# Altium schematic sheet module 2_ACCEL_GYRO.SchDoc
size 242 x 148 mm
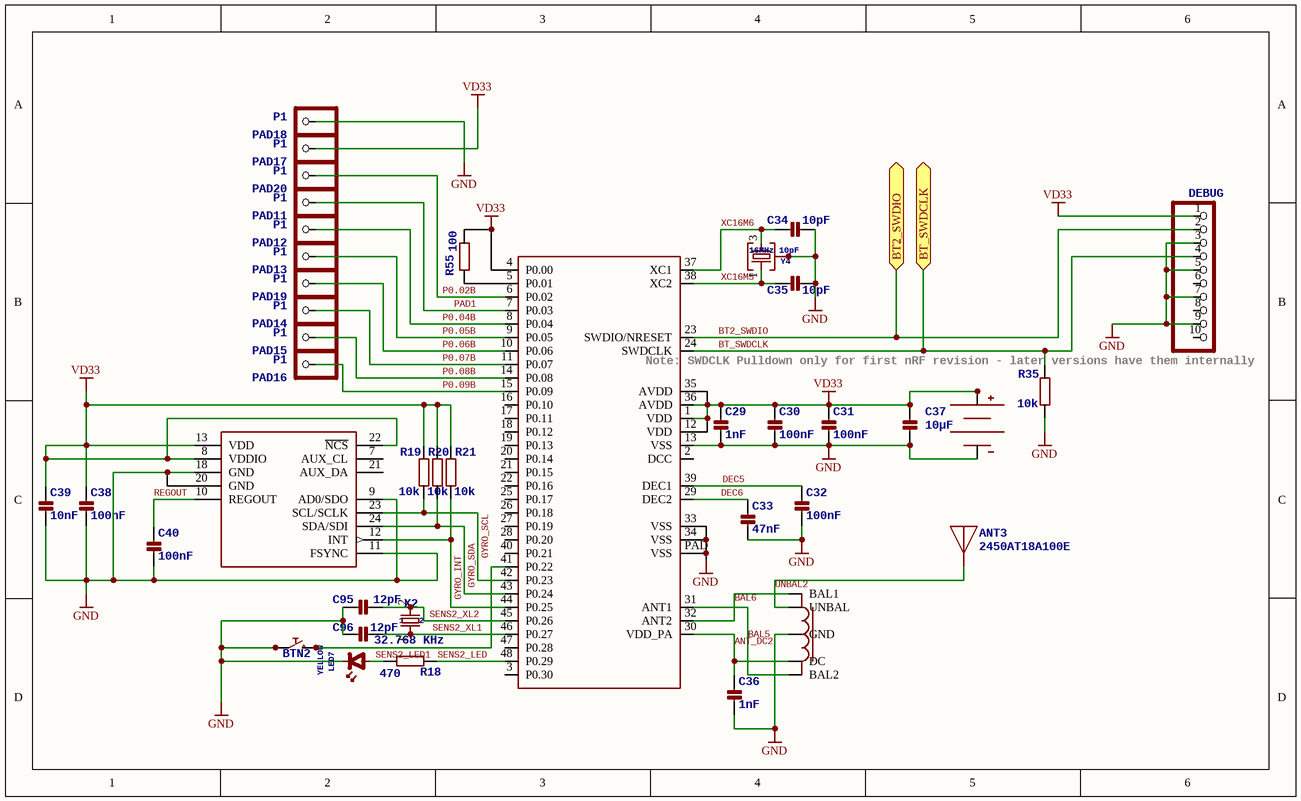
[diagram p0: module 2_ACCEL_GYRO.SchDoc]

## Parts
ANT3  2450AT18A100E  [1206_MINIMELF_COMBO]
BALUN2  2450BM14A0002T  [6-PIN-0603]  (value not drawn)
BAT2  BATTERYBK-912  [BK-912]  (value not drawn)
BT2  NRF51822QFN48  [QFN48_EP]  (value not drawn)
BTN2  Tact Sw 4.6x2.8  [CK-KMR2]  (value not drawn)
C29  1nF  [0402]
C30  100nF  [0402]
C31  100nF  [0402]
C32  100nF  [0402]
C33  47nF  [0402]
C34  10pF  [0402]
C35  10pF  [0402]
C36  1nF  [0402]
C37  10µF  [0603]
C38  100nF  [0402]
C39  10nF  [0402]
C40  100nF  [0402]
C95  12pF  [0402]
C96  12pF  [0402]
DEBUG2  DEBUG  [2X05_SMT]  (no BOM)
LED7  YELLOW  [0402_POLAR]
PAD11  P1  [PCB_MEDIUM_RECT_PAD]  (no BOM)
PAD12  P1  [PCB_MEDIUM_RECT_PAD]  (no BOM)
PAD13  P1  [PCB_MEDIUM_RECT_PAD]  (no BOM)
PAD14  P1  [PCB_MEDIUM_RECT_PAD]  (no BOM)
PAD15  P1  [PCB_MEDIUM_RECT_PAD]  (no BOM)
PAD16  P1  [PCB_MEDIUM_RECT_PAD]  (no BOM)
PAD17  P1  [PCB_MEDIUM_RECT_PAD]  (no BOM)
PAD18  P1  [PCB_MEDIUM_RECT_PAD]  (no BOM)
PAD19  P1  [PCB_MEDIUM_RECT_PAD]  (no BOM)
PAD20  P1  [PCB_MEDIUM_RECT_PAD]  (no BOM)
R18  470  [0402]
R19  10k  [0402]
R20  10k  [0402]
R21  10k  [0402]
R35  10k  [0402]
R55  100  [0402]
SENSE2  MPU6500QFN  [QFN24-0.4]  (value not drawn)
X2  32.768 KHz  [1206_MINIMELF_COMBO]
Y4  16MHz 10pF  [CRYSTAL25X20]

## Ports
BT2_SWDIO, BT_SWDCLK

## Nets
GND: BALUN2.2(GND) BAT2.- BT2.13(VSS) BT2.33(VSS) BT2.34(VSS) BT2.PAD(VSS) BTN2.P1 BTN2.P2 C29.2 C30.2 C31.2 C32.2 C33.2 C34.2 C35.2 C36.2 C37.2(P2) C38.2 C39.2 C40.2 C95.1 C96.1 DEBUG2.3 DEBUG2.5 DEBUG2.7 DEBUG2.9 LED7.K(CATHODE) PAD18.1 R35.1 SENSE2.9(AD0/SDO) SENSE2.11(FSYNC) SENSE2.18(GND) SENSE2.20(GND) Y4.2 Y4.4
VD33: BAT2.+1(+) BAT2.+2(+) BT2.1(VDD) BT2.4(P0.00) BT2.12(VDD) BT2.35(AVDD) BT2.36(AVDD) C29.1 C30.1 C31.1 C37.1(P1) C38.1 C39.1 DEBUG2.1 PAD17.1 R19.2 R20.2 R21.2 R55.1 SENSE2.8(VDDIO) SENSE2.13(VDD) SENSE2.22(~{NCS})
ANT_DC2: BALUN2.5(DC) BT2.30(VDD_PA) C36.1
BAL5: BALUN2.4(BAL2) BT2.31(ANT1)
BAL6: BALUN2.3(BAL1) BT2.32(ANT2)
BT2_SWDIO: BT2.23(SWDIO/NRESET) DEBUG2.2 ; port BT2_SWDIO
BT_SWDCLK: BT2.24(SWDCLK) DEBUG2.4 R35.2 ; port BT_SWDCLK
DEC5: BT2.39(DEC1) C32.1
DEC6: BT2.29(DEC2) C33.1
GYRO_INT: BT2.44(P0.25) R21.1 SENSE2.12(INT)
GYRO_SCL: BT2.42(P0.23) R19.1 SENSE2.23(SCL/SCLK)
GYRO_SDA: BT2.43(P0.24) R20.1 SENSE2.24(SDA/SDI)
P0.02B: BT2.6(P0.02) PAD20.1
P0.04B: BT2.8(P0.04) PAD12.1
P0.05B: BT2.9(P0.05) PAD13.1
P0.06B: BT2.10(P0.06) PAD19.1
P0.07B: BT2.11(P0.07) PAD14.1
P0.08B: BT2.14(P0.08) PAD15.1
P0.09B: BT2.15(P0.09) PAD16.1
PAD1: BT2.7(P0.03) PAD11.1
REGOUT: C40.1 SENSE2.10(REGOUT)
SENS2_LED: BT2.48(P0.29) R18.1
SENS2_LED1: LED7.A(ANODE) R18.2
SENS2_XL1: BT2.46(P0.27) C96.2 X2.1
SENS2_XL2: BT2.45(P0.26) C95.2 X2.2
UNBAL2: ANT3.1(ANT) BALUN2.1(UNBAL)
XC16M5: BT2.38(XC2) C35.1 Y4.1
XC16M6: BT2.37(XC1) C34.1 Y4.3
NetBT2_5: BT2.5(P0.01) R55.2
NetBT2_41: BT2.41(P0.22) BTN2.P3 BTN2.P4

Not connected (* = marked no-connect by the designer): BT2 2(DCC) 3(P0.30) 16(P0.10) 17(P0.11) 18(P0.12) 19(P0.13) 20(P0.14) 21(P0.15) 22(P0.16) 25(P0.17) 26(P0.18) 27(P0.19) 28(P0.20) 40(P0.21) 47(P0.28); DEBUG2 6 8 10; SENSE2 7(AUX_CL) 21(AUX_DA)

## Notes on the sheet
- (near BT2) Note: SWDCLK Pulldown only for first nRF revision - later versions have them internally

## Library data of the parts
ANT3 = ANTENNA_MONOPOLE1206: 2.45 GHz Antenna; SMD: Yes
BALUN2 = BALUN: 2.45 GHz Impedance Matched Balun-Filter; SMD: Yes
BAT2 = BATTERYBK-912: Coin battery holder; SMD: Yes
BT2 = NRF51822QFN48: Nordic Bluetooth 4.0 low energy modul; SMD: Yes
BTN2 = PUSHBUTTONKMR2XX: Push button; SMD: Yes
C29-C36 C38-C40 C95 C96 = CAP_CERAMIC0402: Ceramic Capacitor; SMD: Yes
C37 = CAP_CERAMIC0603: Ceramic Capacitor; SMD: Yes
DEBUG2 = HEADER-2X5SMD-1.27MM: cortex DEBUG connector
LED7 = LED0402: LED common; SMD: Yes
PAD11-PAD20 = HEADER-1X1SMD_MEDIUM: <b>PIN HEADER</b>
R18-R21 R35 R55 = R-EU_0402: RESISTOR; SMD: Yes
SENSE2 = MPU6500QFN: Invensense MPU6500 combined gyro + accelerometer, I2C; SMD: Yes
X2 = CRYSTAL1206: CL05C120JB5; 1: 1; 2: 2; SMD: Yes
Y4 = CRYSTAL_WITH_GROUND25X20: 16MHz crystal 2.5x2mm; SMD: Yes